# Altium schematic sheet ST_LINK_V2-1.SchDoc
size A4; Organization: Altium Limited; Address1: L3, 12a Rodborough Rd; Address2: Frenchs Forest; Address3: NSW; Address4: Australia 2086; DocumentNumber: 3; SheetNumber: 3; SheetTotal: 5
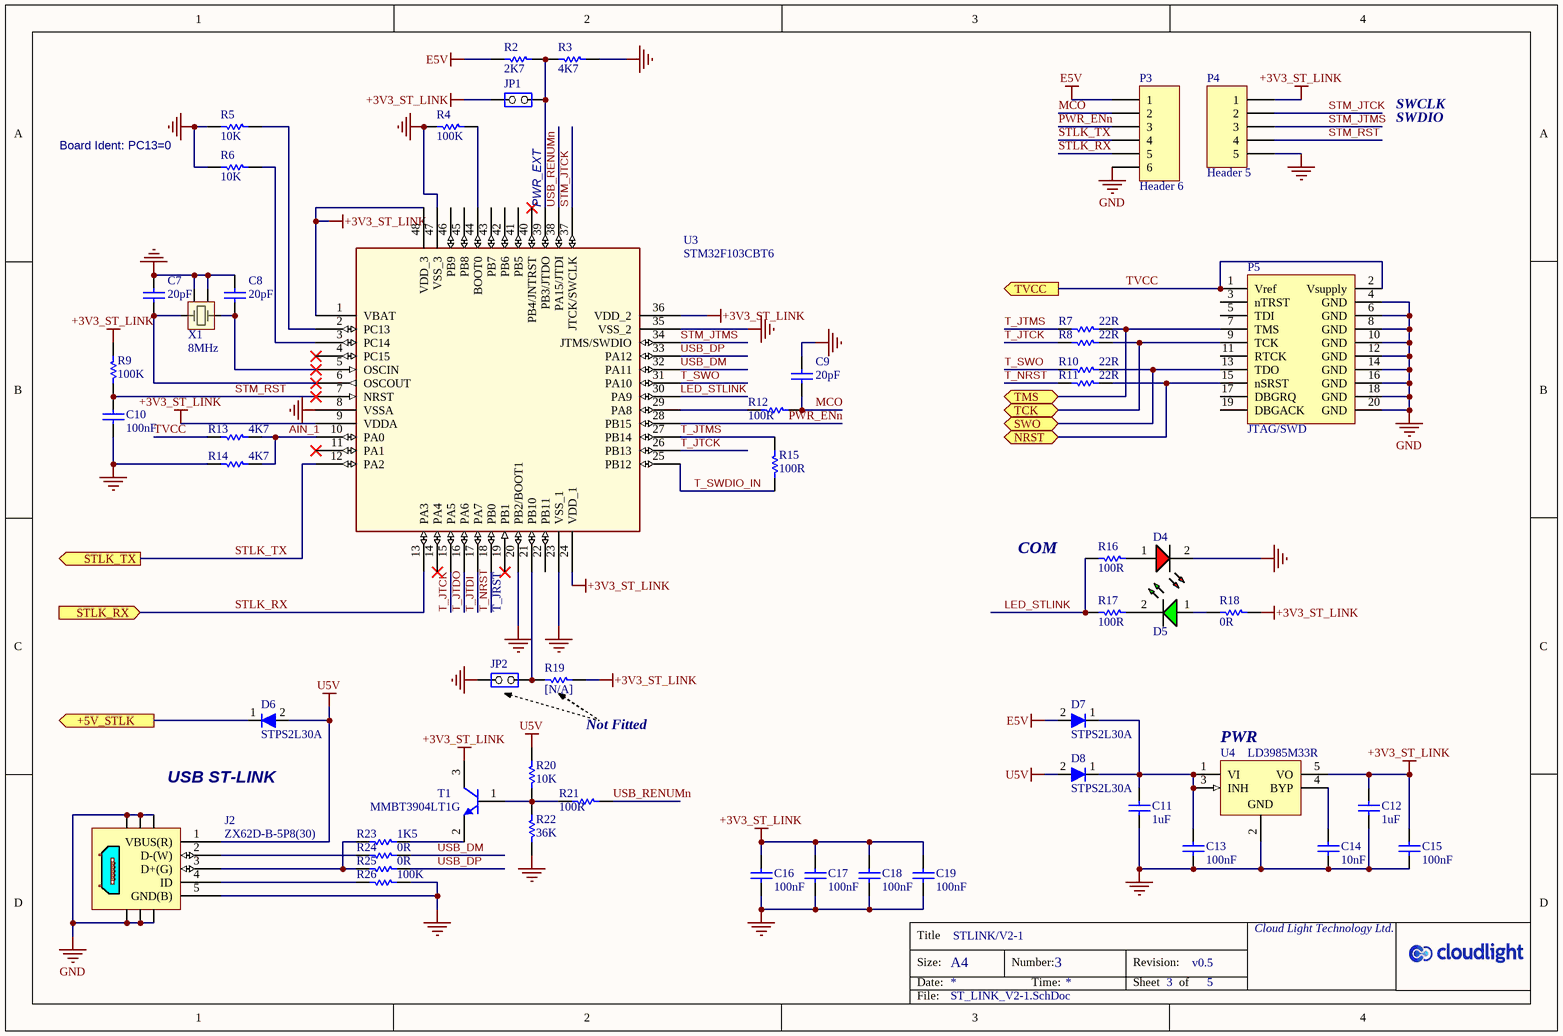
[diagram p0: ST_LINK_V2-1.SchDoc]

## Parts
C7  20pF  [CAPC1608N]
C8  20pF  [CAPC1608N]
C9  20pF  [CAPC1608N]
C10  100nF  [CAPC1608N]
C11  1uF  [CAPC1608N]
C12  1uF  [CAPC1608N]
C13  100nF  [CAPC1608N]
C14  10nF  [CAPC1608N]
C15  100nF  [CAPC1608N]
C16  100nF  [CAPC1608N]
C17  100nF  [CAPC1608N]
C18  100nF  [CAPC1608N]
C19  100nF  [CAPC1608N]
D4  LED-SMD0603-R  [CD1608-0603]  (value not drawn)
D5  LED-SMD0603-G  [CD1608-0603]  (value not drawn)
D6  STPS2L30A  [DIOM4326X25N]
D7  STPS2L30A  [DIOM4326X25N]
D8  STPS2L30A  [DIOM4326X25N]
J2  ZX62D-B-5P8(30)  [USB2.0-4H5]
JP1  JP2  [SIP2/2.54]  (value not drawn)
JP2  JP2  [SIP2/2.54]  (value not drawn)
P3  Header 6  [HDR1X6]
P4  Header 5  [HDR1X5]
P5  JTAG/SWD  [HDR2X10/T2.54/B2C]
R2  2K7  [RESC1608N]
R3  4K7  [RESC1608N]
R4  100K  [RESC1608N]
R5  10K  [RESC1608N]
R6  10K  [RESC1608N]
R7  22R  [RESC1608N]
R8  22R  [RESC1608N]
R9  100K  [RESC1608N]
R10  22R  [RESC1608N]
R11  22R  [RESC1608N]
R12  100R  [RESC1608N]
R13  4K7  [RESC1608N]
R14  4K7  [RESC1608N]
R15  100R  [RESC1608N]
R16  100R  [RESC1608N]
R17  100R  [RESC1608N]
R18  0R  [RESC1608N]
R19  [N/A]  [RESC1608N]
R20  10K  [RESC1608N]
R21  100R  [RESC1608N]
R22  36K  [RESC1608N]
R23  1K5  [RESC1608N]
R24  0R  [RESC1608N]
R25  0R  [RESC1608N]
R26  100K  [RESC1608N]
T1  MMBT3904LT1G  [ONSC-SOT-23-3-318-08_V]
U3  STM32F103CBT6  [QFP48 7X7]
U4  LD3985M33R  [SOT23-5L_N]
X1  8MHz  [12SMX-B-N]

## Ports
+5V_STLK, NRST, STLK_RX (in), STLK_TX (out), SWO, TCK, TMS, TVCC

## Nets
+3V3_ST_LINK: C12.2 C15.2 C16.2 C17.2 C18.2 C19.2 JP1.1(COMMON) P4.1 R9.2 R18.1 R19.1 T1.3(C) U3.1(VBAT) U3.9(VDDA) U3.24(VDD_1) U3.36(VDD_2) U3.48(VDD_3) U4.5(VO)
E5V: D7.2(A) P3.1 R2.1
GND: C7.2 C8.2 C9.2 C10.1 C11.1 C12.1 C13.1 C14.1 C15.1 C16.1 C17.1 C18.1 C19.1 D4.2(RK) J2.5(GND(B)) J2.6 J2.7 J2.8 J2.9 J2.10 J2.11 JP2.1(COMMON) P3.6 P4.5 P5.4(GND) P5.6(GND) P5.8(GND) P5.10(GND) P5.12(GND) P5.14(GND) P5.16(GND) P5.18(GND) P5.20(GND) R3.2 R4.1 R5.1 R6.1 R14.1 R22.1 R26.2 U3.8(VSSA) U3.20(PB2/BOOT1) U3.23(VSS_1) U3.35(VSS_2) U3.47(VSS_3) U4.2(GND) X1.2(GND) X1.4(GND)
U5V: D6.2(A) D8.2(A) J2.1(VBUS(R)) R20.2
+5V_STLK: D6.1(K) ; port +5V_STLK
AIN_1: R13.2 R14.2 U3.10(PA0)
LED_STLINK: R16.2 R17.2 U3.30(PA9)
MCO: C9.1 P3.2 R12.2
NRST: P5.15(nSRST) R11.2 ; port NRST
PWR_ENn: P3.3 U3.28(PB15)
STLK_RX: P3.5 U3.13(PA3) ; port STLK_RX
STLK_TX: P3.4 U3.12(PA2) ; port STLK_TX
STM_JTCK: P4.2 U3.37(JTCK/SWCLK)
STM_JTMS: P4.3 U3.34(JTMS/SWDIO)
STM_RST: C10.2 P4.4 R9.1 U3.7(NRST)
SWO: P5.13(TDO) R10.2 ; port SWO
T_JTCK: R8.1 U3.15(PA5) U3.26(PB13)
T_JTDI: U3.17(PA7)
T_JTDO: U3.16(PA6)
T_JTMS: R7.1 R15.2 U3.27(PB14)
T_NRST: R11.1 U3.18(PB0)
T_SWDIO_IN: R15.1 U3.25(PB12)
T_SWO: R10.1 U3.31(PA10)
TCK: P5.9(TCK) R8.2 ; port TCK
TMS: P5.7(TMS) R7.2 ; port TMS
TVCC: P5.1(Vref) P5.2(Vsupply) R13.1 ; port TVCC
USB_DM: R24.2 U3.32(PA11)
USB_DP: R25.2 U3.33(PA12)
USB_RENUMn: R21.2 U3.38(PA15/JTDI)
NetC7_1: C7.1 U3.6(OSCOUT) X1.3(OSC2)
NetC8_1: C8.1 U3.5(OSCIN) X1.1(OSC1)
NetC11_2: C11.2 C13.2 D7.1(K) D8.1(K) U4.1(VI) U4.3(INH)
NetC14_2: C14.2 U4.4(BYP)
NetD4_1: D4.1(RA) R16.1
NetD5_1: D5.1(RA) R18.2
NetD5_2: D5.2(RK) R17.1
NetJ2_2: J2.2(D-(W)) R24.1
NetJ2_3: J2.3(D+(G)) R23.1 R25.1
NetJ2_4: J2.4(ID) R26.1
NetJP1_2: JP1.2(NO) R2.2 R3.1 U3.39(PB3/JTDO)
NetJP2_2: JP2.2(NO) R19.2 U3.21(PB10)
NetR4_2: R4.2 U3.44(BOOT0)
NetR5_2: R5.2 U3.2(PC13)
NetR6_2: R6.2 U3.3(PC14)
NetR12_1: R12.1 U3.29(PA8)
NetR20_1: R20.1 R21.1 R22.2 T1.1(B)
NetR23_2: R23.2 T1.2(E)

Not connected (* = marked no-connect by the designer): P5 3(nTRST) 5(TDI) 11(RTCK) 17(DBGRQ) 19(DBGACK); U3 4(PC15)* 11(PA1)* 14(PA4)* 19(PB1)* 22(PB11) 40(PB4/JNTRST)* 41(PB5) 42(PB6) 43(PB7) 45(PB8) 46(PB9)

## Notes on the sheet
- SWCLK
- Board Ident: PC13=0
- SWDIO
- (near U3) PWR_EXT
- COM
- T_JRST
- USB ST-LINK
- Not Fitted
- (near U4) PWR
- Title
- Size:
- Date:
- A4
- STLINK/V2-1
- Number:
- Time:
- Revision:
- Sheet
- 3
- of
- v0.5
- 5
- Cloud Light Technology Ltd.
- File:
- ST_LINK_V2-1.SchDoc

## Library data of the parts
C7-C9 = Chip Capacitor: Manufacturer: [N/A]; Value: 20pF/100V/C0G/±5%; Revision: V1.0.0; Package: 0603; PackageDescription: 0603 Chip Capacitor; PartNumber: [N/A]; Supplier 1: [N/A]; Supplier Part Number 1: [N/A]; Publisher: Wentao SUN; Published: 16-Apr-2019
C10 C13 C15-C19 = Chip Capacitor: Manufacturer: [N/A]; Value: 100nF/16V/X7R/±10%; Revision: V1.0.0; Package: 0603; PackageDescription: 0603 Chip Capacitor; PartNumber: [N/A]; Supplier 1: [N/A]; Supplier Part Number 1: [N/A]; Publisher: Wentao SUN; Published: 16-Apr-2019
C11 C12 = Chip Capacitor: Manufacturer: [N/A]; Value: 1uF/16V/X7R/±20%; Revision: V1.0.0; Package: 0603; PackageDescription: 0603 Chip Capacitor; PartNumber: [N/A]; Supplier 1: [N/A]; Supplier Part Number 1: [N/A]; Publisher: Wentao SUN; Published: 16-Apr-2019
C14 = Chip Capacitor: Manufacturer: [N/A]; Value: 10nF/25V/X7R/±20%; Revision: V1.0.0; Package: 0603; PackageDescription: 0603 Chip Capacitor; PartNumber: [N/A]; Supplier 1: [N/A]; Supplier Part Number 1: [N/A]; Publisher: Wentao SUN; Published: 16-Apr-2019
D4 = LED-SMD0603-R: Single Color LED Indication, 0603, Red; Manufacturer: [N/A]; ComponentLink1Description: [N/A]; ComponentLink1URL: [N/A]; Package: 0603; PackageDescription: Chip Diode; Body 1.6 x 0.8 mm (LxW typ); PartNumber: [N/A]; Published: 21-Apr-2019; Publisher: Wentao SUN; Supplier 1: [N/A]; Supplier Part Number 1: [N/A]
D5 = LED-SMD0603-G: Single Color LED Indication, 0603, Green; Manufacturer: [N/A]; ComponentLink1Description: [N/A]; ComponentLink1URL: [N/A]; Package: 0603; PackageDescription: Chip Diode; Body 1.6 x 0.8 mm (LxW typ); PartNumber: [N/A]; Published: 21-Apr-2019; Publisher: Wentao SUN; Supplier 1: [N/A]; Supplier Part Number 1: [N/A]
D6-D8 = STPS2L30A: Diode Schottky 30V 2A Surface Mount SMA; Manufacturer: STMicroelectronics; PartNumber: STPS2L30A; Package: DO-214AC, SMA; Supplier 1: Digi-Key; Supplier Part Number 1: 497-3759-1-ND; PackageDescription: Molded Diode, 2-Leads, Body 4.27x2.57mm; ComponentLink1Description: Digi-Key; ComponentLink1URL: https://www.digikey.com/products/en?keywords=497-3759-2-ND; Publisher: Wentao SUN; Published: 18-Apr-2019
J2 = ZX62D-B-5P8(30): USB - micro B USB 2.0 Receptacle Connector 5-Pin; Manufacturer: Hirose Electric Co Ltd; PartNumber: ZX62D-B-5P8(30); Package: USB2.0-4H5; PackageDescription: USB Micro B, 0.65mm Pitch, 4 holes; Supplier 1: Digi-Key; Supplier Part Number 1: H125272CT-ND; ComponentLink1URL: https://www.digikey.com/products/en?keywords=H125272TR-ND; ComponentLink1Description: Digi-Key
JP1 JP2 = JP2: Jumper 2; Manufacturer: [N/A]; PartNumber: [N/A]; Package: HDR2/T2.54/B2B; PackageDescription: Connector; Header; 2 Position; Pitch 2.54mm; Style Board to Board;; Supplier 1: [N/A]; Supplier Part Number 1: [N/A]
P3 = Header 6: Header, 6-Pin; Manufacturer: [N/A]; LatestRevisionDate: 17-Jul-2002; LatestRevisionNote: Re-released for DXP Platform.; Publisher: Altium Limited; PartNumber: [N/A]; Package: HDR6/T2.54/B2B; PackageDescription: Connector; Header; 6 Position; Pitch 2.54mm; Style Board to Board;; Supplier 1: [N/A]; Supplier Part Number 1: [N/A]
P4 = Header 5: Header, 5-Pin; Manufacturer: [N/A]; LatestRevisionDate: 17-Jul-2002; LatestRevisionNote: Re-released for DXP Platform.; Publisher: Altium Limited; PartNumber: [N/A]; Package: HDR5/T2.54/B2B; PackageDescription: Connector; Header; 5 Position; Pitch 2.54mm; Style Board to Board;; Supplier 1: [N/A]; Supplier Part Number 1: [N/A]
P5 = JTAG: Header, JTAG; Manufacturer: On Shore Technology Inc.; PartNumber: 302-S201; LatestRevisionDate: 17-Apr-2019; LatestRevisionNote: Re-released for DXP Platform.; Publisher: Wentao SUN; Package: HDR2X10/T2.54/B2C; PackageDescription: Connector; Header; 10x2 Position; Pitch 2.54mm; Style Board to Cable;; Supplier 1: Digi-Key; Supplier Part Number 1: ED10524-ND; ComponentLink1Description: Digi-Key; ComponentLink1URL: https://www.digikey.com/products/en?keywords=ED10524-ND
R2 = Chip Resistor: Manufacturer: [N/A]; Value: 2K7/±5%/0.1W; Published: 16-Apr-2019; Revision: V1.0.0; Publisher: Wentao SUN; Package: 0603; PackageDescription: 0603 Chip Resistor; PartNumber: [N/A]; Supplier 1: [N/A]; Supplier Part Number 1: [N/A]
R3 R13 R14 = Chip Resistor: Manufacturer: [N/A]; Value: 4K7/±5%/0.1W; Published: 16-Apr-2019; Revision: V1.0.0; Publisher: Wentao SUN; Package: 0603; PackageDescription: 0603 Chip Resistor; PartNumber: [N/A]; Supplier 1: [N/A]; Supplier Part Number 1: [N/A]
R4 R9 R26 = Chip Resistor: Manufacturer: [N/A]; Value: 100K/±5%/0.1W; Published: 16-Apr-2019; Revision: V1.0.0; Publisher: Wentao SUN; Package: 0603; PackageDescription: 0603 Chip Resistor; PartNumber: [N/A]; Supplier 1: [N/A]; Supplier Part Number 1: [N/A]
R5 R6 R20 = Chip Resistor: Manufacturer: [N/A]; Value: 10K/±5%/0.1W; Published: 16-Apr-2019; Revision: V1.0.0; Publisher: Wentao SUN; Package: 0603; PackageDescription: 0603 Chip Resistor; PartNumber: [N/A]; Supplier 1: [N/A]; Supplier Part Number 1: [N/A]
R7 R8 R10 R11 = Chip Resistor: Manufacturer: [N/A]; Value: 22R/±5%/0.1W; Published: 16-Apr-2019; Revision: V1.0.0; Publisher: Wentao SUN; Package: 0603; PackageDescription: 0603 Chip Resistor; PartNumber: [N/A]; Supplier 1: [N/A]; Supplier Part Number 1: [N/A]
R12 R15-R17 R21 = Chip Resistor: Manufacturer: [N/A]; Value: 100R/±5%/0.1W; Published: 16-Apr-2019; Revision: V1.0.0; Publisher: Wentao SUN; Package: 0603; PackageDescription: 0603 Chip Resistor; PartNumber: [N/A]; Supplier 1: [N/A]; Supplier Part Number 1: [N/A]
R18 R24 R25 = Chip Resistor: Manufacturer: [N/A]; Value: 0R/Jumper/0.1W; Published: 16-Apr-2019; Revision: V1.0.0; Publisher: Wentao SUN; Package: 0603; PackageDescription: 0603 Chip Resistor; PartNumber: [N/A]; Supplier 1: [N/A]; Supplier Part Number 1: [N/A]
R19 = Chip Resistor: Published: 16-Apr-2019; Revision: V1.0.0; Publisher: Wentao SUN; Manufacturer: [N/A]; Package: 0603; PackageDescription: 0603 Chip Resistor; PartNumber: [N/A]; Supplier 1: [N/A]; Supplier Part Number 1: [N/A]; Value: [N/A]
R22 = Chip Resistor: Manufacturer: [N/A]; Value: 36K/±5%/0.1W; Published: 16-Apr-2019; Revision: V1.0.0; Publisher: Wentao SUN; Package: 0603; PackageDescription: 0603 Chip Resistor; PartNumber: [N/A]; Supplier 1: [N/A]; Supplier Part Number 1: [N/A]
R23 = Chip Resistor: Manufacturer: [N/A]; Value: 1K5/±5%/0.1W; Published: 16-Apr-2019; Revision: V1.0.0; Publisher: Wentao SUN; Package: 0603; PackageDescription: 0603 Chip Resistor; PartNumber: [N/A]; Supplier 1: [N/A]; Supplier Part Number 1: [N/A]
T1 = MMBT3904LT1G: General Purpose Transistor, NPN Silicon, 3-Pin SOT-23, Pb-Free, Tape and Reel; Manufacturer: On Semiconductor; fT Min (MHz): 300; IC Continuous (A): 0.2; DatasheetVersion: Rev. 12; PackageVersion: Rev. AP, 11/2009; PackageReference: SOT-23-3-318-08; PackageDescription: 3-Pin Small Outline Transistor, Body 2.92 x 1.3 mm, Pitch 0.95 mm; Supplier 1: Digi-Key; Supplier Part Number 1: MMBT3904LT1GOSCT-ND; Supplier 2: Digi-Key; Supplier Part Number 2: MMBT3904LT1GOSTR-ND; Supplier 3: Digi-Key; Supplier Part Number 3: MMBT3904LT1GOSDKR-ND; Supplier 4: Farnell; Supplier Part Number 4: 2317804; Supplier 5: Farnell; Supplier Part Number 5: 1459100; Supplier 6: Farnell; Supplier Part Number 6: 1459100RL; Supplier 7: Newark; Supplier Part Number 7: 83K0942; Supplier 8: Newark; Supplier Part Number 8: 83H7337; Supplier 9: Newark; Supplier Part Number 9: 28X7922; Supplier 10: Mouser; Supplier Part Number 10: 863-MMBT3904LT1G; Packing: Tape and Reel; Polarity: NPN; RoHS: TRUE; Mounting Technology: Surface Mount; PartNumber: MMBT3904LT1G; ComponentLink1Description: Manufacturer URL; ComponentLink1URL: http://www.onsemi.com/; ComponentLink2Description: Datasheet; ComponentLink2URL: http://www.onsemi.cn/pub_link/Collateral/MMBT3904LT1-D.PDF; ComponentLink3Description: Package Specification; ComponentLink3URL: http://www.onsemi.cn/pub_link/Collateral/318-08.PDF; Package: SOT-23-3-318-08
U3 = STM32F103CBT6: Medium-density performance line ARM-based 32-bit MCU with 64KB Flash; PartNumber: STM32F103C8T6TR; Manufacturer: STMicroelectronics; Package: LQFP48; PackageDescription: TSQFP, 48-Leads, Body 7.0x7.0mm (max), Pitch 0.50mm; Supplier 1: Digi-Key; Supplier Part Number 1: 497-17666-1-ND; Published: 23-Apr-2019; Publisher: Wentao SUN
U4 = LD3985M33R: 150mA, Ultra-Low Drop Low Noise BiCMOS Voltage Regulators Low ESR Capacitors Compatible, 3.3V, 5-Pin SOT23-5L; Manufacturer: STMicroelectronics; DatasheetVersion: Jan-2011; PackageVersion: 2008; PackageReference: SOT23-5L; PackageDescription: 5-Pin SOT-23 Package, 2.9 x 1.6 mm Body, 0.95 mm Pitch, 2.8 mm Lead Span; PartNumber: LD3985M33R; ComponentLink1Description: Digi-Key; ComponentLink1URL: https://www.digikey.com/products/en?keywords=497-3504-2-ND; ComponentLink2Description: Datasheet; ComponentLink2URL: http://www.st.com/internet/com/TECHNICAL_RESOURCES/TECHNICAL_LITERATURE/DATASHEET/CD00003395.pdf; Package: SOT23-5L; Supplier 1: Digi-Key; Supplier Part Number 1: 497-3504-1-ND
X1 = LFXTAL056516REEL: 8MHz ±30ppm Crystal 12pF 80 Ohms 4-SMD, No Lead; Manufacturer: IQD Frequency Product Ltd.; Package: 12SMX-B; PackageDescription: 4-SMD, No Lead; PartNumber: LFXTAL056516REEL; Supplier 1: Digi-Key; Supplier Part Number 1: 1923-1017-1-ND; Value: 8MHz